# Altium schematic sheet sensor10DOF-S.SchDoc
size A
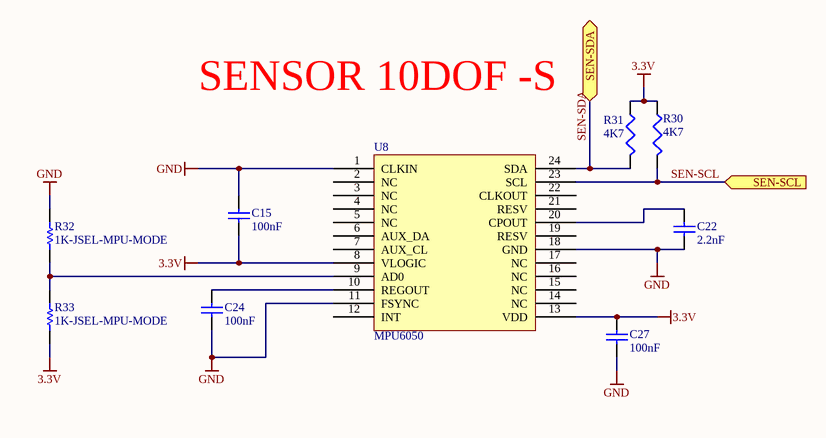
[diagram p0: sensor10DOF-S.SchDoc]

## Parts
C15  100nF  [2012[0805]]
C22  2.2nF  [2012[0805]]
C24  100nF  [2012[0805]]
C27  100nF  [2012[0805]]
R30  4K7  [2012[0805]]
R31  4K7  [2012[0805]]
R32  1K-JSEL-MPU-MODE  [2012[0805]]
R33  1K-JSEL-MPU-MODE  [2012[0805]]
U8  MPU6050  [QFN_36]

## Ports
SEN-SCL (in), SEN-SDA

## Nets
3.3V: C15.1 C27.2 R30.1 R31.1 R33.1 U8.8(VLOGIC) U8.13(VDD)
GND: C15.2 C22.1 C24.1 C27.1 R32.2 U8.1(CLKIN) U8.11(FSYNC) U8.18(GND)
SEN-SCL: R30.2 U8.23(SCL) ; port SEN-SCL
SEN-SDA: R31.2 U8.24(SDA) ; port SEN-SDA
NetC22_2: C22.2 U8.20(CPOUT)
NetC24_2: C24.2 U8.10(REGOUT)
NetR32_1: R32.1 R33.2 U8.9(AD0)

Not connected (* = marked no-connect by the designer): U8 2(NC) 3(NC) 4(NC) 5(NC) 6(AUX_DA) 7(AUX_CL) 12(INT) 14(NC) 15(NC) 16(NC) 17(NC) 19(RESV) 21(RESV) 22(CLKOUT)

## Notes on the sheet
- SENSOR 10DOF -S

## Library data of the parts
C15 C24 C27 = Cap: Capacitor; Published: 8-Jun-2000; LatestRevisionDate: 17-Jul-2002; LatestRevisionNote: Re-released for DXP Platform.; PackageReference: RAD-0.3; Publisher: Altium Limited; Value: 100nF
C22 = Cap: Capacitor; Value: 100nF; Published: 8-Jun-2000; LatestRevisionDate: 17-Jul-2002; LatestRevisionNote: Re-released for DXP Platform.; PackageReference: RAD-0.3; Publisher: Altium Limited
R30 R31 = Res3: Resistor; Value: 10K; Published: 8-Jun-2000; LatestRevisionDate: 04-Mar-2005; LatestRevisionNote: PCB Footprint replaced.; PackageReference: J1-0603; Publisher: Altium Limited
R32 R33 = Res1: Resistor; Value: 1K; Published: 8-Jun-2000; LatestRevisionDate: 17-Jul-2002; LatestRevisionNote: Re-released for DXP Platform.; PackageReference: AXIAL-0.3; Publisher: Altium Limited